# EAGLE design bear (EAGLE 7.2.0)
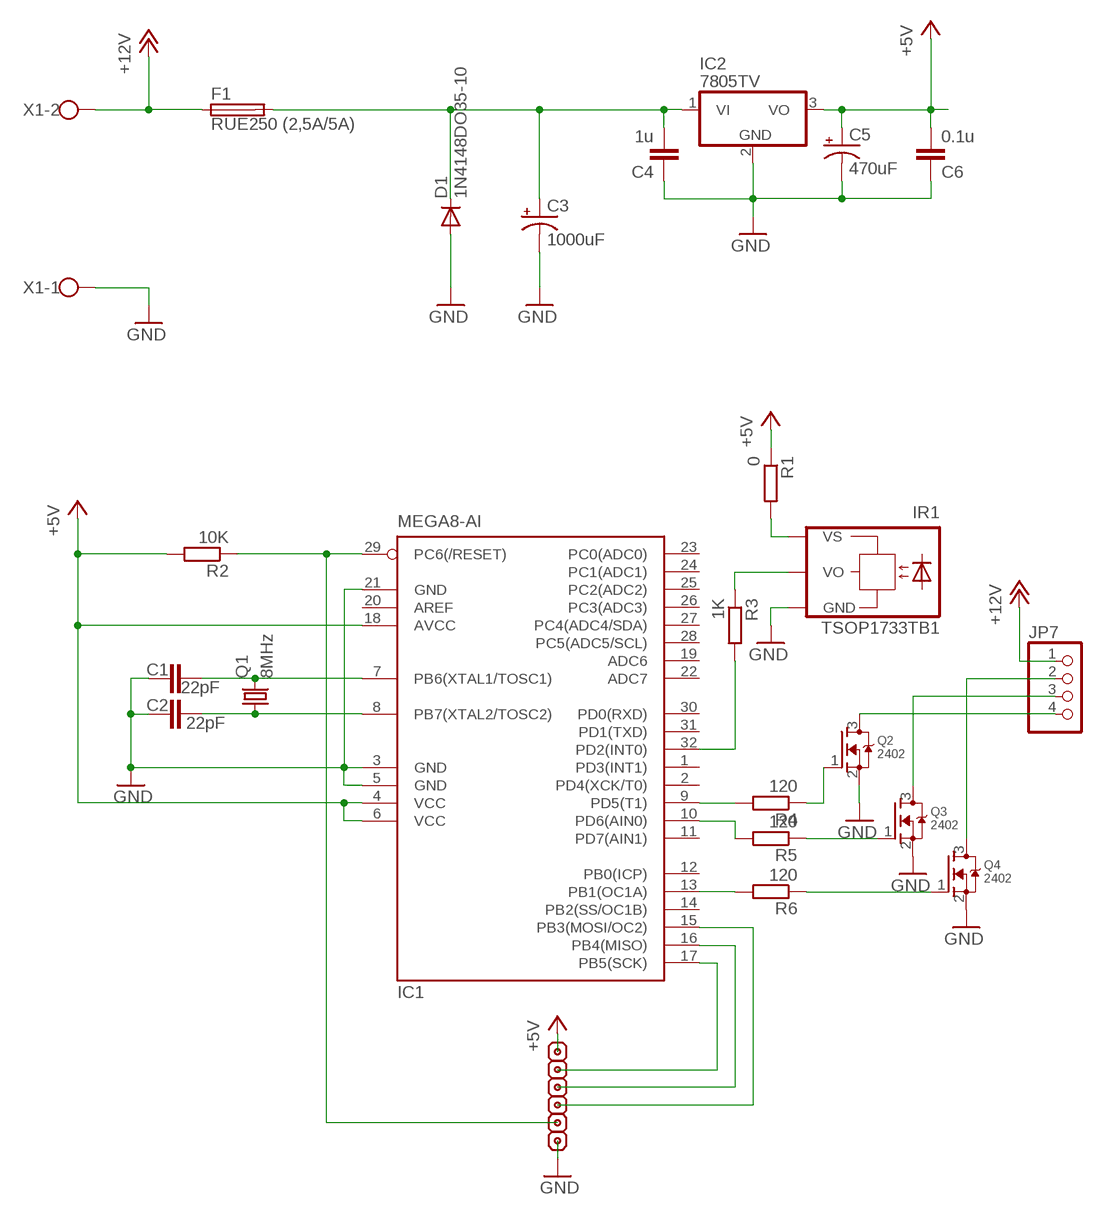
[diagram p0: schematic, sheet 1]

## Parts
C1  22pF  C-EUC1206  [C1206]
C2  22pF  C-EUC1206  [C1206]
C3  1000uF  CPOL-USE5-10.5  [E5-10,5]
C4  1u  C-EUC1206K  [C1206K]
C5  470uF  CPOL-USE5-8.5  [E5-8,5]
C6  0.1u  C-EUC1206K  [C1206K]
D1  1N4148DO35-10  [DO35-10]
F1  RUE250 (2,5A/5A)  TE5  [TE5]
IC1  MEGA8-AI  [TQFP32-08]
IC2  7805TV  [TO220V]
IR1  TSOP1733TB1  [TSOP17_TB1]
JP7  PINHD-1X4_2.54  [1X04]
JP_5V  PINHD-1X1_2.54  [1X01]
JP_GND  PINHD-1X1_2.54  [1X01]
JP_MISO  PINHD-1X1_2.54  [1X01]
JP_MOSI  PINHD-1X1_2.54  [1X01]
JP_RST  PINHD-1X1_2.54  [1X01]
JP_SCK  PINHD-1X1_2.54  [1X01]
Q1  8MHz  CRYSTALHC49S  [HC49/S]
Q2  2402  MOSFET-NREFLOW  [SOT23]
Q3  2402  MOSFET-NREFLOW  [SOT23]
Q4  2402  MOSFET-NREFLOW  [SOT23]
R1  0  R-EU_R1206  [R1206]
R2  10K  R-EU_R1206  [R1206]
R3  1K  R-EU_R1206  [R1206]
R4  120  R-EU_R1206  [R1206]
R5  120  R-EU_R1206  [R1206]
R6  120  R-EU_R1206  [R1206]
X1  W237-102  [W237-102]

## Nets
+5V: C5.+ C6.2 IC1.4(VCC) IC1.6(VCC) IC1.18(AVCC) IC2.3(VO) JP_5V.1(PIN) R1.1 R2.2
+12V: F1.1 JP7.1 X1.2
GND: C1.1 C2.1 C3.- C4.1 C5.- C6.1 D1.A IC1.3(GND) IC1.5(GND) IC1.21(GND) IC2.2(GND) IR1.GND JP_GND.1(PIN) Q2.2(S) Q3.2(S) Q4.2(S) X1.1
N$1: IC1.32(PD2(INT0)) R3.2
N$2: IR1.VO R3.1
N$3: C3.+ C4.2 D1.C F1.2 IC2.1(VI)
N$4: JP7.4 Q2.3(D)
N$5: JP7.3 Q3.3(D)
N$6: JP7.2 Q4.3(D)
N$7: IC1.9(PD5(T1)) R4.2
N$8: Q2.1(G) R4.1
N$9: IC1.10(PD6(AIN0)) R5.2
N$10: Q3.1(G) R5.1
N$11: IC1.13(PB1(OC1A)) R6.2
N$12: C1.2 IC1.7(PB6(XTAL1/TOSC1)) Q1.2
N$13: IR1.VS R1.2
N$14: IC1.17(PB5(SCK)) JP_SCK.1(PIN)
N$15: Q4.1(G) R6.1
N$16: IC1.16(PB4(MISO)) JP_MISO.1(PIN)
N$17: IC1.15(PB3(MOSI/OC2)) JP_MOSI.1(PIN)
N$22: C2.2 IC1.8(PB7(XTAL2/TOSC2)) Q1.1
RESET: IC1.29(PC6(/RESET)) JP_RST.1(PIN) R2.1
Unconnected: IC1.1(PD3(INT1)) IC1.2(PD4(XCK/T0)) IC1.11(PD7(AIN1)) IC1.12(PB0(ICP)) IC1.14(PB2(SS/OC1B)) IC1.19(ADC6) IC1.20(AREF) IC1.22(ADC7) IC1.23(PC0(ADC0)) IC1.24(PC1(ADC1)) IC1.25(PC2(ADC2)) IC1.26(PC3(ADC3)) IC1.27(PC4(ADC4/SDA)) IC1.28(PC5(ADC5/SCL)) IC1.30(PD0(RXD)) IC1.31(PD1(TXD))

## Library data of the parts
C1 C2 C4 C6 = rcl:C-EU: CAPACITOR, European symbol
C3 = rcl:CPOL-US: POLARIZED CAPACITOR, American symbol
C5 = resistor:CPOL-US: POLARIZED CAPACITOR, American symbol
D1 = diode:1N4148: DIODE high speed (Philips)
F1 = fuse:TE5: FUSE Wickmann; OC_FARNELL: unknown; OC_NEWARK: unknown
IC1 = atmel:MEGA8: MICROCONTROLLER 8 Kbytes FLASH, 1 kbytes SRAM, 512 bytes EEPROM, USART, 6-channel 10 bit ADC, 2-channel 8 bit ADC Pin compatible with Atmega48, ATMega88, ATMega168 Source: avr.lbr; MPN: ATMEGA8-16AU; OC_FARNELL: 9171371; OC_NEWARK: 73M8863
IC2 = linear:78*: Positive VOLTAGE REGULATOR Source: http://cache.national.com/ds/LM/LM78L05.pdf http://www.fairchildsemi.com/ds/LM/LM7805.pdf
IR1 = telefunken:TSOP17*TB1: TSOP17..TB1 IR Receiver Modules for Remote Control Systems Source: http://www.vishay.com/docs/82042/82042.pdf; OC_FARNELL: unknown; OC_NEWARK: unknown
JP7 = pinhead-1:PINHD-1X4: PIN HEADER
JP_5V JP_GND JP_MISO JP_MOSI JP_RST JP_SCK = mypin:PINHD-1X1: PIN HEADER
Q1 = crystal:CRYSTAL: CRYSTAL; OC_FARNELL: 1667008; OC_NEWARK: unknown
Q2-Q4 = adafruit:MOSFET-N: N-Channel Mosfet 2N7002E - 60V 260mA SOT23 [Digikey: 2N7002ET1GOSTR-ND] - REEL BSH103 - 30V 850mA SOT23 [Digikey: 568-5013-1-ND]
R1-R6 = rcl:R-EU_: RESISTOR, European symbol
X1 = con-wago-500:W237-102: WAGO SCREW CLAMP; MPN: 237-102; OC_FARNELL: unknown; OC_NEWARK: 70K9898

## Board
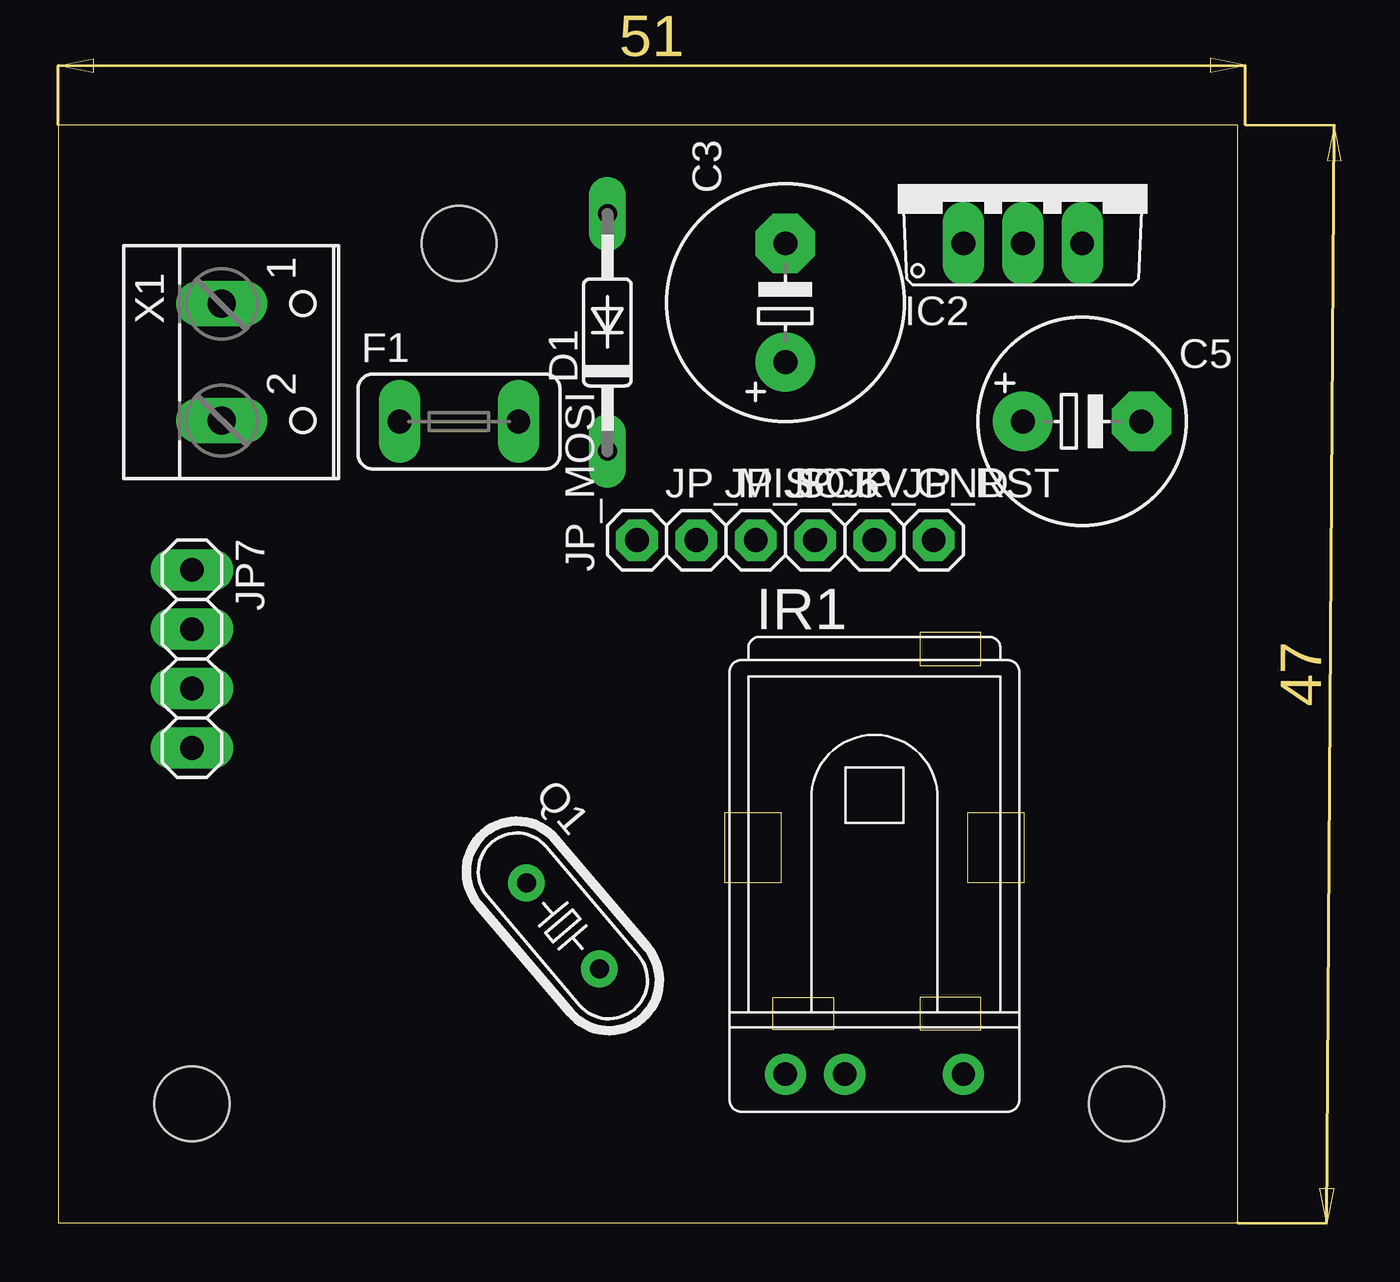
[diagram p1: board, top side]
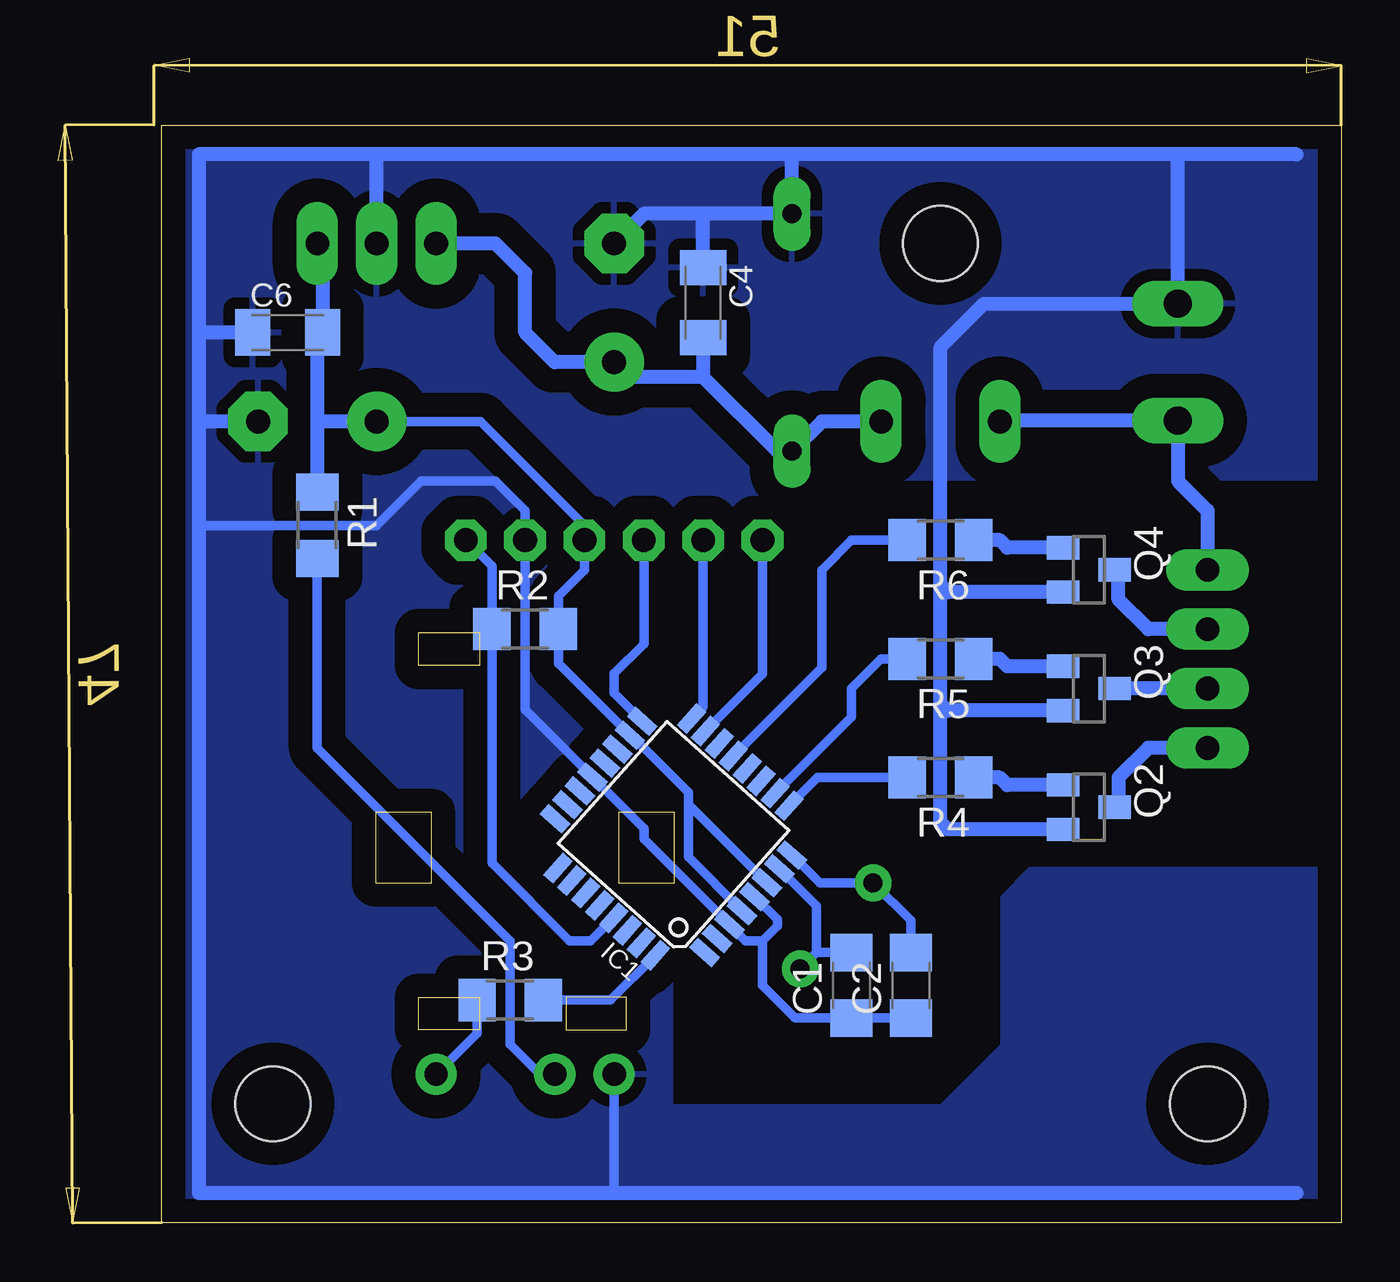
[diagram p2: board, bottom side, seen from below]

Size 50.47 x 46.98 mm. Coordinates in mm from the lower left corner, seen from the top.
Outline: 0,0 50.47,0 50.47,46.98 0,46.98 0,0
Copper layers (1*16): Top 0.035mm / dielectric 1.5mm / Bottom 0.035mm
Design rules "zsl": minimum track width 16mil, minimum drill 24mil, track to track 10mil, track to pad 10mil, pad to pad 10mil, via to via 10mil, smd to smd 10mil, copper to edge 40mil, drill to drill 40mil, minimum pad ring 15mil, minimum via ring 15mil, stop-mask expansion 4mil, vias tented up to drill 0mil, thermal gap 20mil
Holes 3.2 mm at 17.14,41.91 5.71,5.08 45.72,5.08

### Footprints (pad centres in the part's own frame; a part is rotated, then mirrored left to right if it is on the bottom)
C1206 = smd 1.6 x 1.8: 1 -1.4,0; 2 1.4,0
E5-10,5 = drill 1.016 pad 2.54: + -2.54,0 | drill 1.016 pad 2.54 octagon: - 2.54,0
C1206K = smd 1.5 x 2: 1 -1.5,0; 2 1.5,0
E5-8,5 = drill 1.016 pad 2.54: + -2.54,0 | drill 1.016 pad 2.54 octagon: - 2.54,0
DO35-10 = drill 0.813 long: A 5.08,0; C -5.08,0
TE5 = drill 1.016 long: 1 -2.54,0; 2 2.54,0
TQFP32-08 = smd 1.27 x 0.559: 1 -4.293,2.8; 2 -4.293,2; 3 -4.293,1.2; 4 -4.293,0.4; 5 -4.293,-0.4; 6 -4.293,-1.2; 7 -4.293,-2; 8 -4.293,-2.8; 17 4.293,-2.8; 18 4.293,-2; 19 4.293,-1.2; 20 4.293,-0.4; 21 4.293,0.4; 22 4.293,1.2; 23 4.293,2; 24 4.293,2.8 | smd 0.559 x 1.27: 9 -2.8,-4.293; 10 -2,-4.293; 11 -1.2,-4.293; 12 -0.4,-4.293; 13 0.4,-4.293; 14 1.2,-4.293; 15 2,-4.293; 16 2.8,-4.293; 25 2.8,4.293; 26 2,4.293; 27 1.2,4.293; 28 0.4,4.293; 29 -0.4,4.293; 30 -1.2,4.293; 31 -2,4.293; 32 -2.8,4.293
TO220V = drill 1.016 long: 1 -2.54,-2.54; 2 0,-2.54; 3 2.54,-2.54
TSOP17_TB1 = drill 1 pad 1.676: GND 0,-3.81; VO 0,3.81; VS 0,-1.27
1X04 = drill 1.016 long: 1 -3.81,0; 2 -1.27,0; 3 1.27,0; 4 3.81,0
1X01 = drill 1.016 octagon: 1 0,0
HC49/S = drill 0.813: 1 -2.413,0; 2 2.413,0
SOT23 = smd 1 x 1.4: 1 -0.95,-1.1; 2 0.95,-1.1; 3 0,1.1
R1206 = smd 1.6 x 1.803: 1 -1.422,0; 2 1.422,0
W237-102 = drill 1.194 long: 1 -2.5,-1.27; 2 2.5,-1.27

### Placement (x,y rotation side)
C1  20.95,10.16 90 bottom
C2  18.41,10.16 90 bottom
C3  31.11,39.37 90 top
C4  27.3,39.37 270 bottom
C5  43.81,34.29 0 top
C6  45.09,38.1 0 bottom
D1  23.5,38.1 90 top
F1  17.14,34.29 0 top
IC1  28.57,16.51 138.2 bottom
IC2  41.27,44.45 0 top
IR1  34.92,6.35 270 top
JP7  5.71,24.13 270 top
JP_5V  32.38,29.21 0 top
JP_GND  34.92,29.21 0 top
JP_MISO  27.3,29.21 0 top
JP_MOSI  24.77,29.21 90 top
JP_RST  37.47,29.21 0 top
JP_SCK  29.84,29.21 0 top
Q1  21.59,12.7 310.3 top
Q2  10.79,17.78 270 bottom
Q3  10.79,22.86 270 bottom
Q4  10.79,27.94 270 bottom
R1  43.81,29.84 270 bottom
R2  34.92,25.4 0 bottom
R3  35.56,9.53 0 bottom
R4  17.14,19.05 180 bottom
R5  17.14,24.13 180 bottom
R6  17.14,29.21 180 bottom
X1  8.26,36.83 270 top

### Tracks (layer width: path | path; a pad name or v marks a point on that pad's centre or on a via)
+5V
  Bottom 0.406: IC1.6 27.94,17.91 | 27.94,17.91 27.94,18.41 30.39,20.86 IC1.18 33.5,23.92 R2.2 33.5,26.82 32.38,27.94 JP_5V.1 32.38,29.84 36.83,34.29 C5.+ | IC1.4 27.94,15.65 27.94,17.91
  Bottom 0.61: IC2.3 43.59,41.68 C6.2 43.81,37.87 43.81,34.29 | 43.81,34.29 R1.1 | C5.+ 43.81,34.29
+12V
  Bottom 0.61: JP7.1 5.71,30.48 6.99,31.75 X1.2 14.56,34.33 F1.1
GND
  Bottom 0.406: IC1.5 24.13,12.97 24.13,12.7 24.77,12.06 | 24.77,12.06 25.49,12.06 IC1.3 29.84,16.42 29.84,16.88 IC1.21 34.92,21.96 JP_GND.1 | C2.1 C1.1 23.36,8.76 24.77,10.16 24.77,12.06 | IR1.GND 31.11,1.27 | JP_GND.1 34.92,29.84 | JP_GND.1 34.92,30.48 36.2,31.75 39.37,31.75 41.27,29.84 48.9,29.84
  Bottom 0.61: Q2.2 16.83,16.83 17.14,17.14 17.14,22.23 | 17.14,22.23 17.14,27.3 | 17.14,27.3 17.14,37.47 15.28,39.33 X1.1 6.99,45.72 | Q4.2 16.83,26.99 17.14,27.3 | Q3.2 16.83,21.91 17.14,22.23 | 6.99,45.72 23.5,45.72 | 23.5,45.72 41.27,45.72 | 41.27,45.72 48.9,45.72 48.9,38.1 | 48.9,38.1 48.9,34.29 | 48.9,34.29 48.9,29.84 48.9,1.27 31.11,1.27 1.91,1.27 | 1.91,45.72 6.99,45.72 | IC2.2 41.27,45.72 | 23.5,45.72 D1.A 27.3,43.18 | 27.3,43.18 29.84,43.18 C3.- | C4.1 27.3,43.18 | C6.1 48.9,38.1 | C5.- 48.9,34.29
  pour Bottom (isolate 1.016): -1.27,46.99 52.07,46.99 52.07,-1.27 -1.27,-1.27
N$1
  Bottom 0.406: IC1.32 31.27,9.53 R3.2
N$2
  Bottom 0.406: R3.1 36.98,8.1 IR1.VO
N$3
  Bottom 0.61: F1.2 22.23,34.29 D1.C 24.13,33.02 27.3,36.2 | 27.3,36.2 30.48,36.2 C3.+ 33.66,36.83 34.92,38.1 34.92,40.64 36.2,41.91 IC2.1 | C4.2 27.3,36.2
N$4
  Bottom 0.61: JP7.4 8.26,20.32 9.53,19.05 9.53,17.95 Q2.3
N$5
  Bottom 0.61: JP7.3 Q3.3
N$6
  Bottom 0.61: JP7.2 8.26,25.4 9.53,26.67 9.53,27.77 Q4.3
N$7
  Bottom 0.406: R4.2 22.42,19.05 IC1.9
N$8
  Bottom 0.61: Q2.1 14.29,18.73 14.61,19.05 R4.1
N$9
  Bottom 0.406: R5.2 19.68,24.13 20.95,22.86 20.95,21.64 IC1.10
N$10
  Bottom 0.61: Q3.1 14.29,23.81 14.61,24.13 R5.1
N$11
  Bottom 0.406: R6.2 20.95,29.21 22.23,27.94 22.23,23.76 IC1.13
N$12
  Bottom 0.406: C1.2 22.45,11.56 | 22.45,11.56 Q1.2 | IC1.7 22.45,13.55 22.45,11.56
N$13
  Bottom 0.406: IR1.VS 34.29,6.35 35.56,7.62 35.56,12.06 43.81,20.32 R1.2
N$14
  Bottom 0.406: IC1.17 31.11,22.66 31.11,23.5 29.84,24.77 JP_SCK.1
N$15
  Bottom 0.61: Q4.1 14.29,28.89 14.61,29.21 R6.1
N$16
  Bottom 0.406: JP_MISO.1 27.3,22.07 IC1.16
N$17
  Bottom 0.406: JP_MOSI.1 24.77,23.48 IC1.15
N$18
  cutout Bottom: 0.64,31.75 19.68,31.75 23.5,27.94 23.5,16.51 28.57,11.43 28.57,5.08 17.14,5.08 14.61,7.62 14.61,13.97 13.34,15.24 0.64,15.24
N$19
  cutout Bottom: 23.5,16.51 29.21,21.59 33.66,16.51 27.94,11.43
N$22
  Bottom 0.406: IC1.8 22.31,14.54 Q1.1 18.41,12.93 C2.2
RESET
  Bottom 0.406: IC1.29 32.12,12.06 33.02,12.06 36.35,15.39 R2.1 36.35,28.09 JP_RST.1